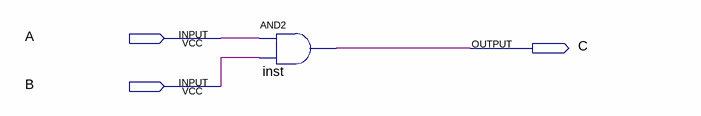
[diagram p0: schematic sheet]
// Quartus schematic TPdeBaseQ9.bdf as structural Verilog: 1 symbols, 3 pins
module TPdeBaseQ9 (
  input  A,
  input  B,
  output C
);

  and inst (C, A, B);
endmodule
